# EAGLE schematic ECE_362_mini_project2 (EAGLE 7.5.0)
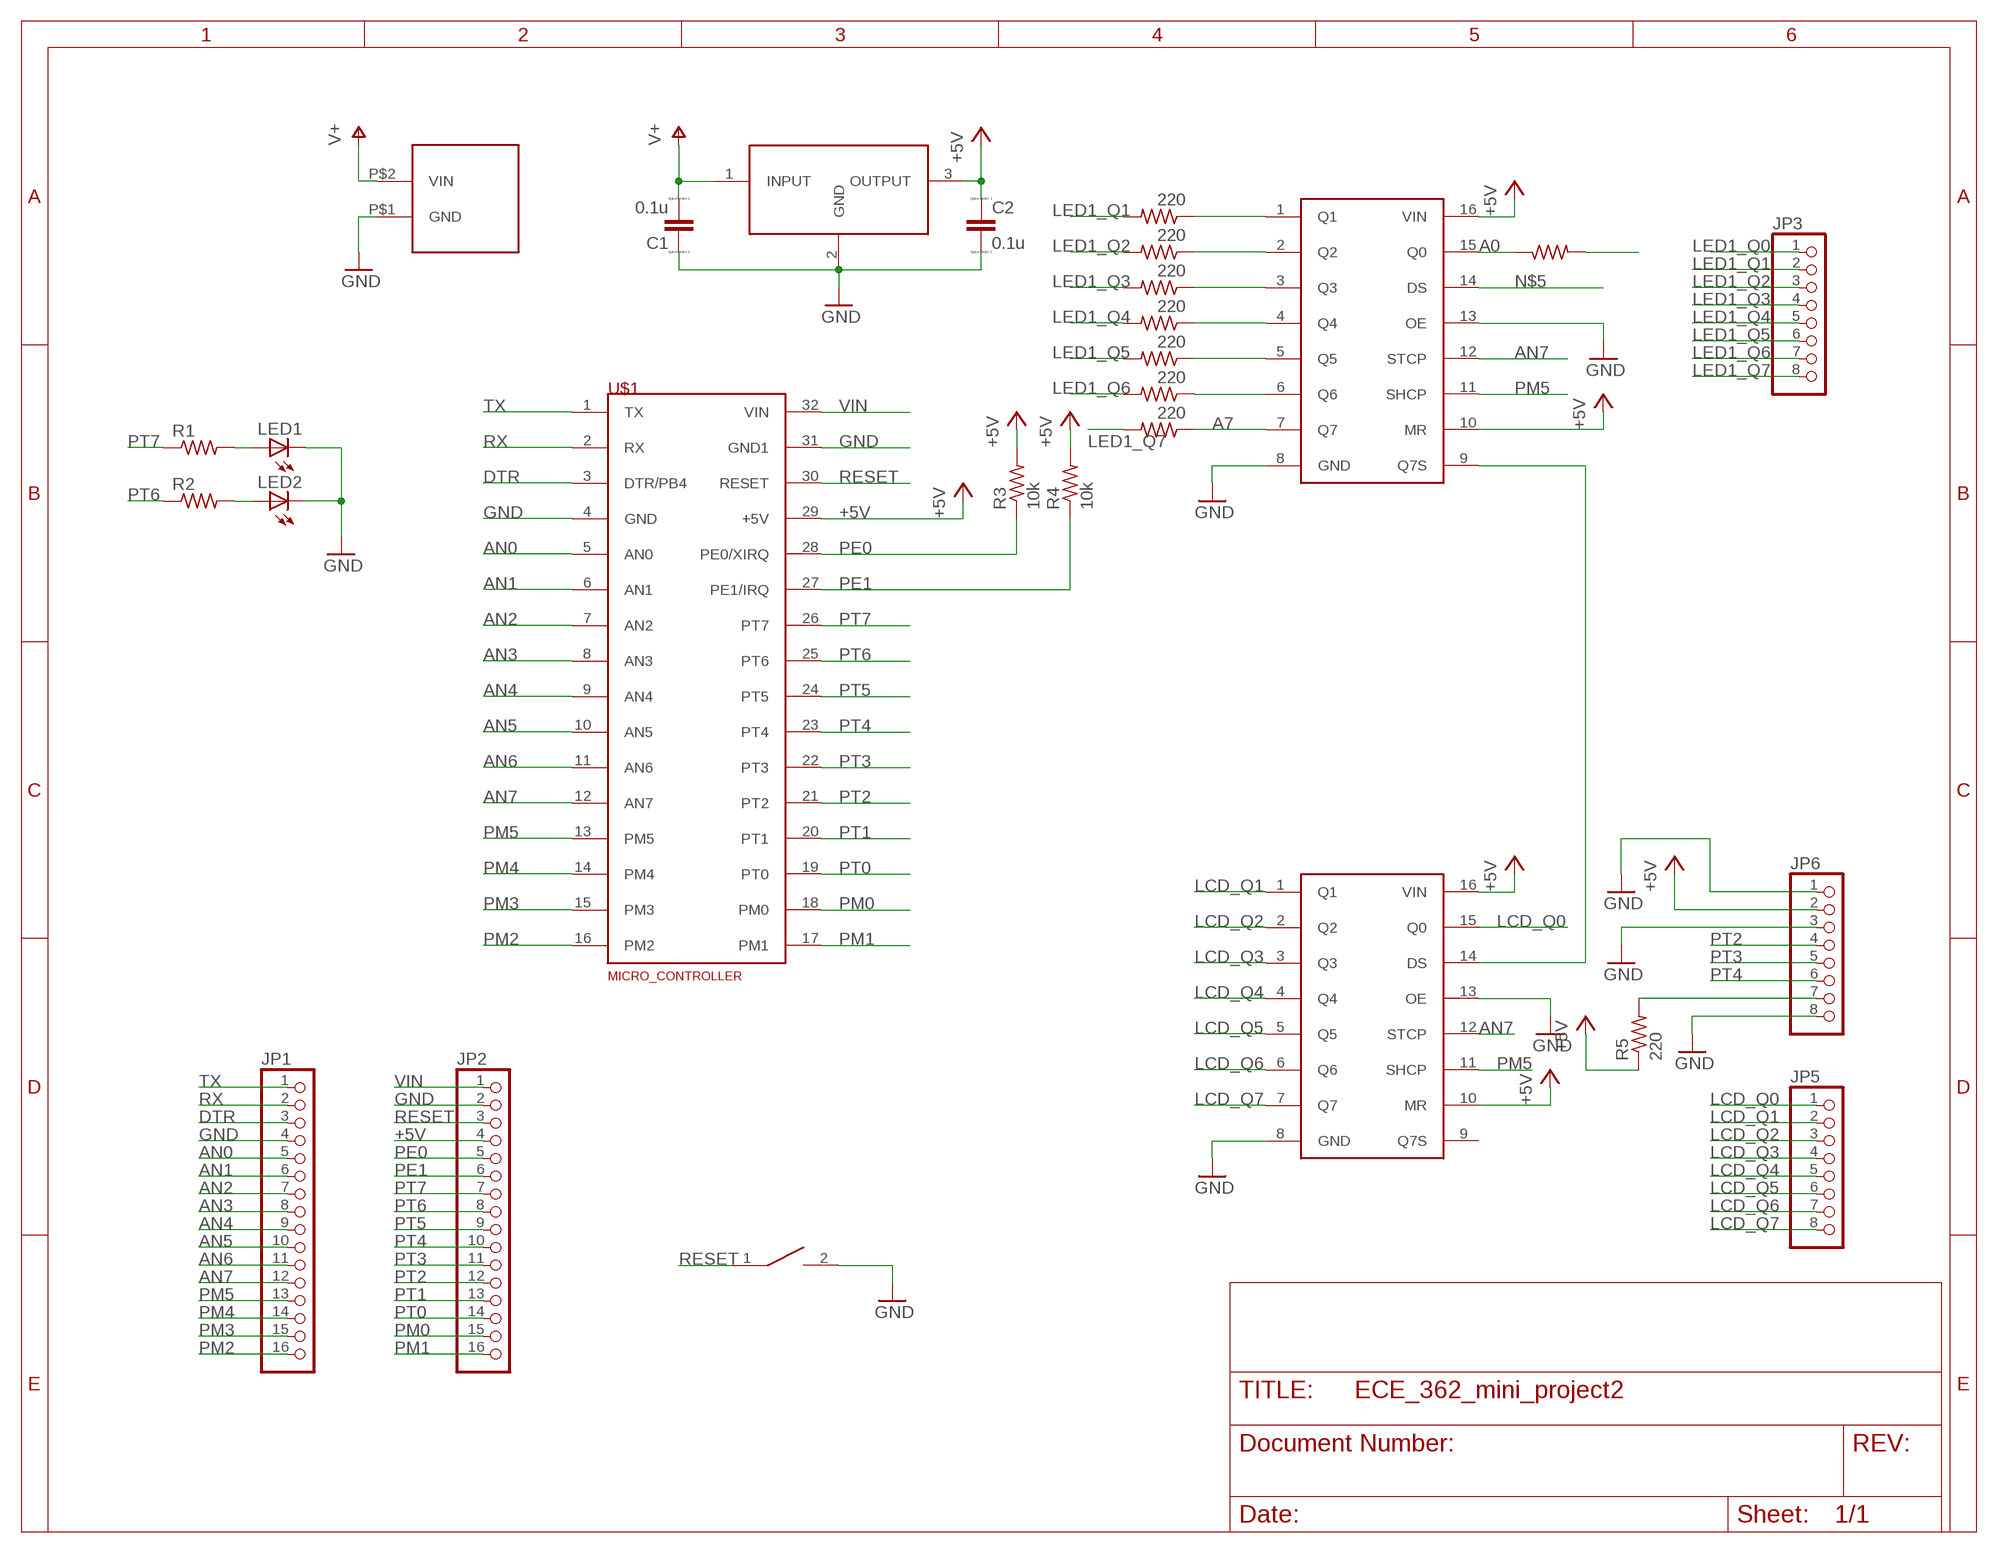
[diagram p0: schematic, sheet 1]

## Parts
BOOT_SW  SWITCH  [SW_2512]
C1  0.1u  CC0603  [C0603]
C2  0.1u  CC0603  [C0603]
JP1  PINHD-1X16  [1X16]
JP2  PINHD-1X16  [1X16]
JP3  PINHD-1X8  [1X08]
JP5  PINHD-1X8  [1X08]
JP6  PINHD-1X8  [1X08]
LED1  LEDCHIPLED_0603  [CHIPLED_0603]
LED2  LEDCHIPLED_0603  [CHIPLED_0603]
R1  R-US_R0603  [R0603]
R2  R-US_R0603  [R0603]
R3  10k  R-US_R0603  [R0603]
R4  10k  R-US_R0603  [R0603]
R5  220  R-US_R0603  [R0603]
R6  220  R-US_R0603  [R0603]
R7  220  R-US_R0603  [R0603]
R8  220  R-US_R0603  [R0603]
R9  220  R-US_R0603  [R0603]
R10  220  R-US_R0603  [R0603]
R11  220  R-US_R0603  [R0603]
R12  220  R-US_R0603  [R0603]
R20  220  R-US_R0603  [R0603]
U$1  MICRO_CONTROLLER  [MICRO_CONTROLLER]
U$2  SHIFT_REGISTER  [N5]
U$3  XT60  [XT60]
U$5  SHIFT_REGISTER  [N5]
U$6  L7805CV  [L7805CV]

## Nets
+5V: C2.1 JP2.4 JP6.2 R3.2 R4.2 R5.1 U$1.29(+5V) U$2.10(MR) U$2.16(VIN) U$5.10(MR) U$5.16(VIN) U$6.3(OUTPUT)
A0: R20.1 U$2.15(Q0)
A1: R6.1 U$2.1(Q1)
A2: R7.1 U$2.2(Q2)
A3: R8.1 U$2.3(Q3)
A4: R9.1 U$2.4(Q4)
A5: R10.1 U$2.5(Q5)
A7: R12.1 U$2.7(Q7)
AN0: JP1.5 U$1.5(AN0)
AN1: JP1.6 U$1.6(AN1)
AN2: JP1.7 U$1.7(AN2)
AN3: JP1.8 U$1.8(AN3)
AN4: JP1.9 U$1.9(AN4)
AN5: JP1.10 U$1.10(AN5)
AN6: JP1.11 U$1.11(AN6)
AN7: JP1.12 U$1.12(AN7) U$2.12(STCP) U$5.12(STCP)
DTR: JP1.3 U$1.3(DTR/PB4)
GND: BOOT_SW.2 C1.1 C2.2 JP1.4 JP2.2 JP6.1 JP6.3 JP6.8 LED1.C LED2.C U$1.4(GND) U$1.31(GND1) U$2.8(GND) U$2.13(OE) U$3.P$1(GND) U$5.8(GND) U$5.13(OE) U$6.2(GND)
LCD_Q0: JP5.1 U$5.15(Q0)
LCD_Q1: JP5.2 U$5.1(Q1)
LCD_Q2: JP5.3 U$5.2(Q2)
LCD_Q3: JP5.4 U$5.3(Q3)
LCD_Q4: JP5.5 U$5.4(Q4)
LCD_Q5: JP5.6 U$5.5(Q5)
LCD_Q6: JP5.7 U$5.6(Q6)
LCD_Q7: JP5.8 U$5.7(Q7)
LED1_Q0: JP3.1 R20.2
LED1_Q1: JP3.2 R6.2
LED1_Q2: JP3.3 R7.2
LED1_Q3: JP3.4 R8.2
LED1_Q4: JP3.5 R9.2
LED1_Q5: JP3.6 R10.2
LED1_Q6: JP3.7 R11.2
LED1_Q7: JP3.8 R12.2
N$1: LED1.A R1.2
N$2: LED2.A R2.2
N$3: R11.1 U$2.6(Q6)
N$4: U$2.9(Q7S) U$5.14(DS)
N$5: U$2.14(DS)
N$9: JP6.7 R5.2
PE0: JP2.5 R3.1 U$1.28(PE0/XIRQ)
PE1: JP2.6 R4.1 U$1.27(PE1/IRQ)
PM0: JP2.15 U$1.18(PM0)
PM1: JP2.16 U$1.17(PM1)
PM2: JP1.16 U$1.16(PM2)
PM3: JP1.15 U$1.15(PM3)
PM4: JP1.14 U$1.14(PM4)
PM5: JP1.13 U$1.13(PM5) U$2.11(SHCP) U$5.11(SHCP)
PT0: JP2.14 U$1.19(PT0)
PT1: JP2.13 U$1.20(PT1)
PT2: JP2.12 JP6.4 U$1.21(PT2)
PT3: JP2.11 JP6.5 U$1.22(PT3)
PT4: JP2.10 JP6.6 U$1.23(PT4)
PT5: JP2.9 U$1.24(PT5)
PT6: JP2.8 R2.1 U$1.25(PT6)
PT7: JP2.7 R1.1 U$1.26(PT7)
RESET: BOOT_SW.1 JP2.3 U$1.30(RESET)
RX: JP1.2 U$1.2(RX)
TX: JP1.1 U$1.1(TX)
V+: C1.2 U$3.P$2(VIN) U$6.1(INPUT)
VIN: JP2.1 U$1.32(VIN)
Unconnected: U$5.9(Q7S)

## Library data of the parts
BOOT_SW = MicroBoard:SWITCH
C1 C2 = eagle-ltspice:C: CAPACITOR, European symbol; SPICEMODEL: NONE; SPICEPREFIX: C
JP1 JP2 = mini_project_parts:PINHD-1X16: PIN HEADER
JP3 JP5 JP6 = pinhead:PINHD-1X8: PIN HEADER
LED1 LED2 = led:LED: LED OSRAM: - CHIPLED LG R971, LG N971, LY N971, LG Q971, LY Q971, LO R971, LY R971 LH N974, LH R974 LS Q976, LO Q976, LY Q976 LO Q996 - Hyper CHIPLED LW Q18S LB Q993, LB Q99A, LB R99A - SideLED LS A670, LO A670, LY A670, LG A670, LP A670 LB A673, LV A673, LT A673, LW A673 LH A674 LY A675 LS A676, LA A676, LO A676, LY A676, LW A676 LS A679, LY A679, LG A679 - Hyper Micro SIDELED® LS Y876, LA Y876, LO Y876, LY Y876 LT Y87S - SmartLED LW L88C, LW L88S LB L89C, LB L89S, LG L890 LS L89K, LO L89K, LY L89K LS L896, LA L896, LO L896, LY L896 - TOPLED LS T670, LO T670, LY T670, LG T670, LP T670 LSG T670, LSP T670, LSY T670, LOP T670, LYG T670 LG T671, LOG T671, LSG T671 LB T673, LV T673, LT T673, LW T673 LH T674 LS T676, LA T676, LO T676, LY T676, LB T676, LH T676, LSB T676, LW T676 LB T67C, LV T67C, LT T67C, LS T67K, LO T67K, LY T67K, LW E67C LS E67B, LA E67B, LO E67B, LY E67B, LB E67C, LV E67C, LT E67C LW T67C LS T679, LY T679, LG T679 LS T770, LO T770, LY T770, LG T770, LP T770 LB T773, LV T773, LT T773, LW T773 LH T774 LS E675, LA E675, LY E675, LS T675 LS T776, LA T776, LO T776, LY T776, LB T776 LHGB T686 LT T68C, LB T68C - Hyper Mini TOPLED® LB M676 - Mini TOPLED Santana® LG M470 LS M47K, LO M47K, LY M47K Source: http://www.osram.convergy.de LUXEON: - LUMILED® LXK2-PW12-R00, LXK2-PW12-S00, LXK2-PW14-U00, LXK2-PW14-V00 LXK2-PM12-R00, LXK2-PM12-S00, LXK2-PM14-U00 LXK2-PE12-Q00, LXK2-PE12-R00, LXK2-PE12-S00, LXK2-PE14-T00, LXK2-PE14-U00 LXK2-PB12-K00, LXK2-PB12-L00, LXK2-PB12-M00, LXK2-PB14-N00, LXK2-PB14-P00, LXK2-PB14-Q00 LXK2-PR12-L00, LXK2-PR12-M00, LXK2-PR14-Q00, LXK2-PR14-R00 LXK2-PD12-Q00, LXK2-PD12-R00, LXK2-PD12-S00 LXK2-PH12-R00, LXK2-PH12-S00 LXK2-PL12-P00, LXK2-PL12-Q00, LXK2-PL12-R00 Source: www.luxeon.com KINGBRIGHT: KA-3528ASYC Source: www.kingbright.com
R1-R12 R20 = resistor:R-US_: RESISTOR, American symbol
U$1 = mini_project_parts:MICRO_CONTROLLER
U$2 U$5 = mini_project_parts:SHIFT_REGISTER
U$3 = mini_project_parts:XT60
U$6 = mini_project_parts:L7805CV